# Altium project power_project.PrjPcb
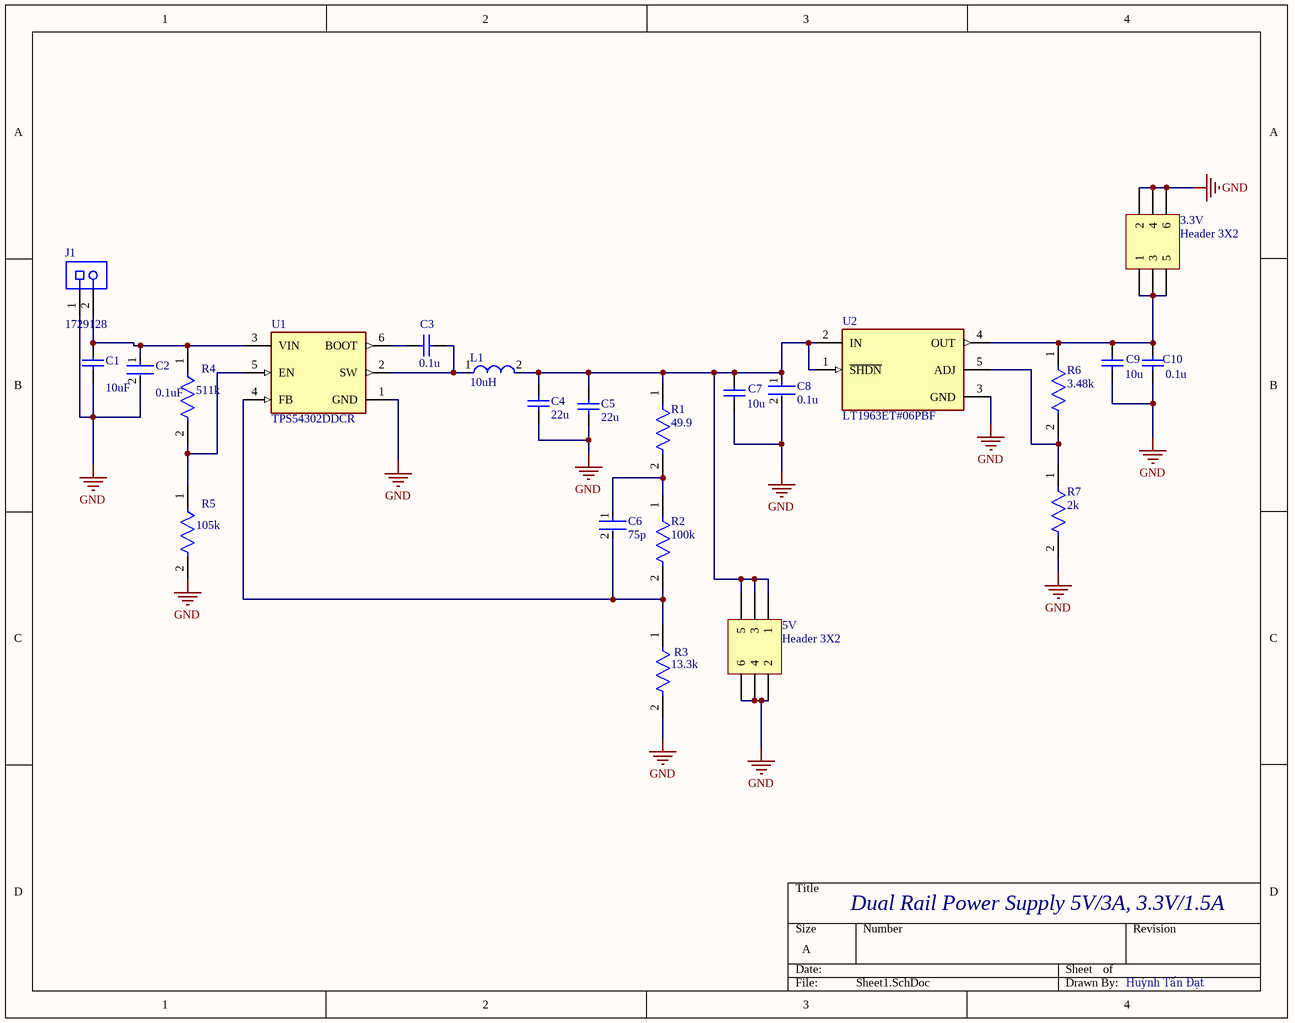
[diagram p0: Sheet1.SchDoc]
1 sheet, 23 parts. Net scope: global (net labels, ports and power ports of the same name join across sheets).
Board file: PCB1.PcbDoc

## Sheet Sheet1.SchDoc
size A; SheetNumber: 1; SheetTotal: 1

### Parts
3.3V  Header 3X2  [HDR2X3]
5V  Header 3X2  [HDR2X3]
C1  value 10uF  [CAPC1206(3216)170_N]
C2  value 0.1uF  [FP-C0603C-CF-MFG]
C3  0.1u  [CAPC1206(3216)170_N]
C4  22u  [CAPC1206(3216)170_N]
C5  22u  [CAPC1206(3216)170_N]
C6  75p  [FP-C0603C-CF-MFG]
C7  10u  [CAPC1206(3216)170_N]
C8  0.1u  [FP-C0603C-CF-MFG]
C9  10u  [CAPC1206(3216)170_N]
C10  0.1u  [CAPC1206(3216)170_N]
J1  1729128  [PHOE-1729128-2_V]
L1  10uH  [FP-IHLP-2525CZ-FP_2_413x3-MFG]
R1  49.9  [FP-TFCR0805-IPC_C]
R2  100k  [FP-TFCR0805-IPC_C]
R3  13.3k  [FP-TFCR0805-IPC_C]
R4  511k  [FP-TFCR0805-IPC_C]
R5  105k  [FP-TFCR0805-IPC_C]
R6  3.48k  [FP-TFCR0805-IPC_C]
R7  2k  [FP-TFCR0805-IPC_C]
U1  TPS54302DDCR  [FP-DDC0006A-MFG]
U2  LT1963ET#06PBF  [FP-T-5-05-08-1421-MFG]

### Nets
GND: 3.3V.2 3.3V.4 3.3V.6 5V.2 5V.4 5V.6 C1.1 C2.2 C4.2 C5.2 C7.1 C8.2 C9.1 C10.1 J1.1 R3.2 R5.2 R7.2 U1.1(GND) U2.3(GND)
Net3.3V_1: 3.3V.1 3.3V.3 3.3V.5 C9.2 C10.2 R6.1 U2.4(OUT)
Net5V_1: 5V.1 5V.3 5V.5 C4.1 C5.1 C7.2 C8.1 L1.2 R1.1 U2.1(~{SHDN}) U2.2(IN)
NetC1_2: C1.2 C2.1 J1.2 R4.1 U1.3(VIN)
NetC3_1: C3.1 L1.1 U1.2(SW)
NetC3_2: C3.2 U1.6(BOOT)
NetC6_1: C6.1 R1.2 R2.1
NetC6_2: C6.2 R2.2 R3.1 U1.4(FB)
NetR4_2: R4.2 R5.1 U1.5(EN)
NetR6_2: R6.2 R7.1 U2.5(ADJ)

### Notes on the sheet
- Dual Rail Power Supply 5V/3A, 3.3V/1.5A
- Huỳnh Tấn Đạt

### Library data of the parts
3.3V 5V = Header 3X2: Header, 3-Pin, Dual row; LatestRevisionDate: 17-Jul-2002; LatestRevisionNote: Re-released for DXP Platform.; Publisher: Altium Limited
C1 C3-C5 C7 C9 C10 = CMP-1037-04598-2: CAP 560nF 25V ±5% 1206 (3216 Metric) Thickness 1.7mm SMD; Tolerance: Â±5%; Case-Metric: 3216; Case-EIA: 1206; Rated Voltage: 25 V; Max Thickness: 1.7 mm; Technology: SMT
  C3-C5 C7 C9 C10: Value: 560nF
C2 = CMP-03020-005974-1: C0603 300 pF X8R 30ppm/°C 1.00% 10 V; Manufacturer Part Number: C0603C301F8HACTU; Manufacturer: KEMET; Voltage Rating: 10 V; Material: Ceramic; Automotive Grade: Grade 1; Capacitance: 300 pF; Tolerance: 0.01; Device Class L2: Capacitors; Temperature Range Low: -55°C; Lead Free: Yes; Height: 0.87mm; Device Class L3: Ceramic Capacitors; Automotive: Yes; Temperature Characteristic: X8R; Temperature Range High: +125°C; RoHS: TRUE; Temperature: -55°C to +125°C; ComponentLink2Description: Datasheet; Category: Cap; Octopart: https://octopart.com/c0603c301f8hactu-kemet-88725572; ComponentLink2URL: https://api.kemet.com/component-edge/download/datasheet/C0603C100J5GACAUTO.pdf; Device Class L1: Passive Components; Temperature Coefficient: 30ppm/°C; Package: C0603C-CF
C6 C8 = CMP-03020-005974-1: C0603 300 pF X8R 30ppm/°C 1.00% 10 V; Manufacturer Part Number: C0603C301F8HACTU; Manufacturer: KEMET; Voltage Rating: 10 V; Material: Ceramic; Automotive Grade: Grade 1; Capacitance: 300 pF; Tolerance: 0.01; Value: 300 pF; Device Class L2: Capacitors; Temperature Range Low: -55°C; Lead Free: Yes; Height: 0.87mm; Device Class L3: Ceramic Capacitors; Automotive: Yes; Temperature Characteristic: X8R; Temperature Range High: +125°C; RoHS: TRUE; Temperature: -55°C to +125°C; ComponentLink2Description: Datasheet; Category: Cap; Octopart: https://octopart.com/c0603c301f8hactu-kemet-88725572; ComponentLink2URL: https://api.kemet.com/component-edge/download/datasheet/C0603C100J5GACAUTO.pdf; Device Class L1: Passive Components; Temperature Coefficient: 30ppm/°C; Package: C0603C-CF
J1 = CMP-2000-05815-1: PCB Terminal Block, 13.5 A, 400 V, 2-Pin THD, RoHS, Bulk; Manufacturer: Phoenix Contact; Package Version: 03/2015; No. of Rows: 1; Pitch: 5.08mm; No. of Positions: 2; Voltage Rating: 400V; Current Rating: 13500mA; Manufacturer URL: http://www.phoenixcontact.com/; Datasheet URL: https://datasheet.ciiva.com/16046/1729128-16046181.pdf; RoHS: TRUE; Package URL: https://www.phoenixcontact.com/online/portal/pi/pxc/product_detail_page/!ut/p/b1/3VdJjqNKFDxLH8AFycySyWY2ozFsEPOMMQaDOX1XedGL_1Vdm5YXJleknhSKeBkvI6EA8ncAo3AYoDhBQGco6KN7VURTdemj9us_IEKEZo_YHiPAEWEFmDGOHMORkqKYCORBZxgL7ZoaZYcbFFUZ3fqxSY6GOuxydWUuHqz1ynmMFygu583Bob0Ewr6Sd_l-5m-kAueHiB0jpRwZwe58wwtkpxtMYd_LmGcDRU02dRNEyWt6Y2ti5pSyJ_reIkzIulrqApdnbT11V5jnCKbYNCvhEM1MCpPByat_X379-iThf08CI5GfOPqfBeS3BRoBOdD55AKVv0iLwCMq-2BrzXWSGRH7pUGD9uwXQjiph3xL0DKQwdGa0JImiIOmBNOestqgwTHSSs2oOep-78apyXQBvNi8ZLaFjvjWvcaUEBu0MC6Wbe-d6mB0FAebo2lUWinqYaZs5DAYzV0RP9yitUjnGJ0iI9xhZkT42OCQNUJJhkgWINNQLP2JFP6OpMg3JCVg70jqHT0lvKOnhHf0lPuOnnLf0VPuWx6_dxwUIvwk5WMkT0kLL1mh61l2yZVSzG3pYV_bqo-mj6uMKwKwdnnW8Jh5RTOJzMOA5c-eJDaZQw4mTMPH02PvS_ZAqNVjVTo2WyYLkwH_KU1mmmG5kjRhDqPXLwwVHvVOjCM60-fpXvTDfMGW1PVFVS1r4e4yVDk4ZdNbkUHvqPqQSeian4UD39fNKmachqdJ1NJbyk8rXT9mXTvPk3oE5meulKGgiruPJek-4I9hTT6G8ZLOyRSm2RRVbThERQad5OS28hdt4YW4vG0stgYYzsWsK4_7y6DZMjJSCqri1kyiZR5vD7pwIrNR7QwPHTcLTI5qT7eRlpHrdGiupYlqQDJ7zy_CND8fWWBoLRXxk1RVcXiBQwbTD4Xi7KL-FuO94t9xaqweXzH; PartNumber: 1729128; Package Description: 2-Pin Through Hole Device, Body 8.1 x 10.16 mm, Pitch 5.08 mm; Datasheet Version: 12/2013; Mounting Technology: ThroughHole; Orientation: Horizontal; Package Reference: 1729128-2; Packing: Bulk
L1 = CMP-02424-000382-1: Commercial Inductors, High Saturation Series, 5 % DCR Tolerance 10uH 3A 97.71mΩ 20%; Saturation Current: 7A; Test Frequency: 100kHz; Shielding: Shielded; DC Resistance (DCR): 97.71mR; Case/Package: 2525; Length: 0.27inch; Radiation Hardening: No; Current Rating: 3A; Min Operating Temperature: -55°C; Height: 3mm; Inductance: 10uH; Lead Free: Lead Free; Packaging: Tape and Reel; Military Standard: Not; Max Operating Temperature: 125°C; Width: 0.255inch; Package Quantity: 2000; Tolerance: 20%; Depth: 6.72mm; Height - Seated (Max): 0.118inch; Mount: Surface Mount
R1-R7 = CMP-250906-233618-1: RES Thin Film,  2kΩ, 0.1%, 0.1W, 25ppm/°C, 0805
U1 = CMP-04918-000032-1: IC REG BUCK ADJ 3A TSOT23-6; Manufacturer: Texas Instruments; Output Voltage: 0.6-26V; Output Type: AdjustableProgrammable; Max Junction Temp: +125°C; Number Of Outputs: 1; Min Supply Voltage: 4.5V; Switching Frequency: 400kHz; Standoff Height: 0mm; Max Duty Cycle: 100%; Nominal Supply Current: 45uA; Max Supply Voltage: 28V; Temperature Range High: +125°C; Switching Topology: Buck; Device Class L2: Power Management ICs; Output Current: 3A; Automotive: No; Temperature Range Low: -40°C; Temperature: -40°C to +125°C; Height: 1.1mm; Ipc Land Pattern Name: SOT95P280X110-6; RoHS: TRUE; Digikey Description: IC REG BUCK ADJ 3A TSOT23-6; Manufacturer Part Number: TPS54302DDCR; ComponentLink2Description: Datasheet; Device Class L3: Voltage Regulators - Switching; Octopart: https://octopart.com/tps54302ddcr-texas+instruments-74209025; Device Class L1: Integrated Circuits (ICs); Lead Free: Yes; ComponentLink2URL: http://www.ti.com/lit/ds/symlink/tps54302.pdf; Category: IC; Package: DDC0006A
U2 = CMP-09138-000238-1: IC REG LIN POS ADJ 1.5A TO220-5; Min Current Limit: 1.6A; Output Voltage: 20V; Dropout Voltage: 340mV; Number of Regulators: 1; Number of Pins: 5; Case/Package: TO-220-5; Max Operating Temperature: 125°C; Package Quantity: 50; Min Operating Temperature: -40°C; RoHS Compliant: Yes; Packaging: Rail/Tube; Mount: Through Hole; Output Current: 1.5A